# Altium schematic sheet CAN&QSPI.SchDoc: CAN & QSPI
size A4; DocumentNumber: MB1165; Revision: C.1; SheetNumber: 11; SheetTotal: 17; Project: STM32469I-EVAL
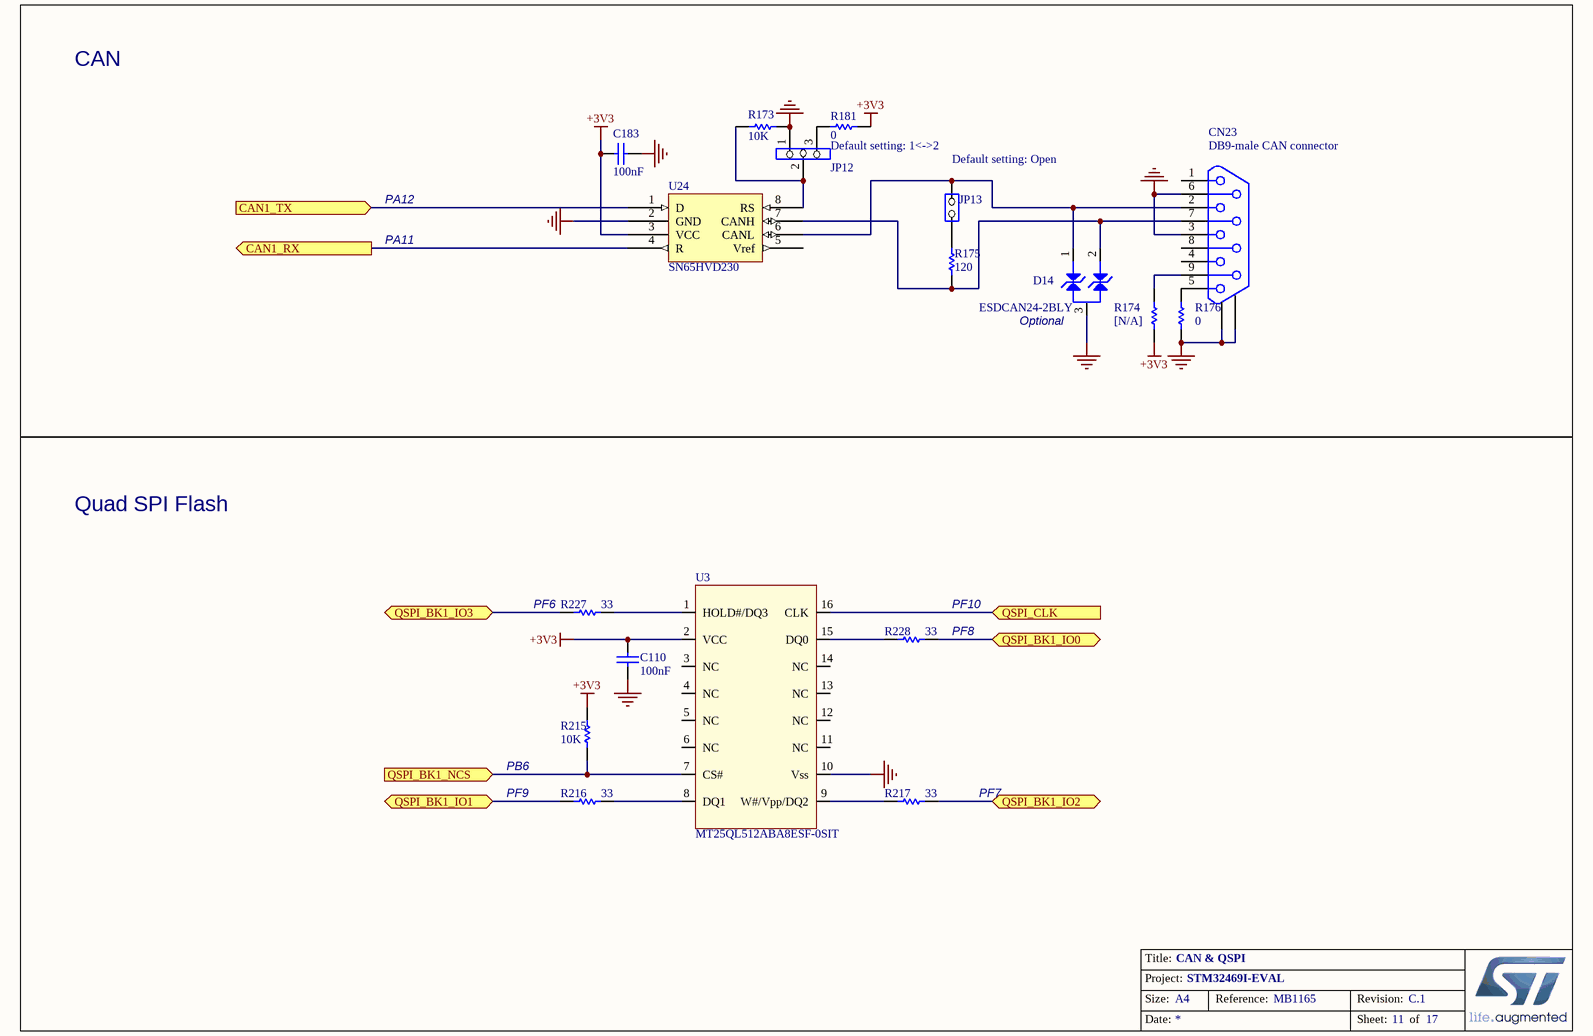
[diagram p0: CAN&QSPI.SchDoc]

## Parts
C110  100nF  [0402C]
C183  100nF  [0603C]
CN23  DB9-male CAN connector  [DB9/M]
D14  ESDCAN24-2BLY  [SOT-23]
JP12  (no value)  [SIP3]
JP13  (no value)  [SIP2]
R173  10K  [0603R]
R174  [N/A]  [0603R]
R175  120  [0603R]
R176  0  [0603R]
R181  0  [0603R]
R215  10K  [0402R]
R216  33  [0603R]
R217  33  [0603R]
R227  33  [0603R]
R228  33  [0603R]
U3  MT25QL512ABA8ESF-0SIT  [SOIC16W_1R27_10R3X10R33]
U24  SN65HVD230  [SOIC8_1R27_4R9X6]

## Ports
CAN1_RX (out), CAN1_TX (in), QSPI_BK1_IO0 (bidir), QSPI_BK1_IO1 (bidir), QSPI_BK1_IO2 (bidir), QSPI_BK1_IO3 (bidir), QSPI_BK1_NCS (in), QSPI_CLK (in)

## Nets
+3V3: C110.1 C183.1 R174.1 R181.2 R215.1 U3.2(VCC) U24.3(VCC)
GND: C110.2 C183.2 CN23.3 CN23.6 CN23.10 CN23.11 D14.3 JP12.1 R173.2 R176.1 U3.10(Vss) U24.2(GND)
CAN1_RX: U24.4(R) ; port CAN1_RX
CAN1_TX: U24.1(D) ; port CAN1_TX
QSPI_BK1_IO0: R228.1 ; port QSPI_BK1_IO0
QSPI_BK1_IO1: R216.2 ; port QSPI_BK1_IO1
QSPI_BK1_IO2: R217.1 ; port QSPI_BK1_IO2
QSPI_BK1_IO3: R227.2 ; port QSPI_BK1_IO3
QSPI_BK1_NCS: R215.2 U3.7(CS#) ; port QSPI_BK1_NCS
QSPI_CLK: U3.16(CLK) ; port QSPI_CLK
NetCN23_2: CN23.2 D14.1 JP13.2(NO) U24.6(CANL)
NetCN23_5: CN23.5 R176.2
NetCN23_7: CN23.7 D14.2 R175.1 U24.7(CANH)
NetCN23_9: CN23.9 R174.2
NetJP12_2: JP12.2 R173.1 U24.8(RS)
NetJP12_3: JP12.3 R181.1
NetJP13_1: JP13.1(COMMON) R175.2
NetR216_1: R216.1 U3.8(DQ1)
NetR217_2: R217.2 U3.9(W#/Vpp/DQ2)
NetR227_1: R227.1 U3.1(HOLD#/DQ3)
NetR228_2: R228.2 U3.15(DQ0)

Not connected (* = marked no-connect by the designer): CN23 1 4 8; U3 3(NC) 4(NC) 5(NC) 6(NC) 11(NC) 12(NC) 13(NC) 14(NC); U24 5(Vref)

## Notes on the sheet
- CAN
- Default setting: 1<->2
- (near JP13) Default setting: Open
- PA12
- PA11
- (near D14) Optional
- Quad SPI Flash
- (near R227) PF6
- (near R228) PF8
- (near R228) PF10
- PB6
- PF9
- (near R217) PF7
- Title:
- Project:
- Size:
- Date:
- A4
- Reference:
- Sheet:
- Revision:
- of

## Library data of the parts
C110 = Cap: Capacitor; Value: 10nF; Ordered by: Subcon; Published: 8-Jun-2000; Revision: July-2002: Re-released for DXP Platform.; Publisher: Altium Limited
C183 = Cap: Capacitor; Value: 10nF; Published: 8-Jun-2000; Revision: July-2002: Re-released for DXP Platform.; Publisher: Altium Limited
CN23 = DB9-CAN
JP12 = Jumper3
JP13 = JP2
R173 R216 R217 R227 R228 = Res1: Resistor; Value: 1K; Published: 8-Jun-2000; Revision: July-2002: Re-released for DXP Platform.; Publisher: Altium Limited
R174-R176 R181 = res1: Resistor; Value: 1K; Published: 8-Jun-2000; Revision: July-2002: Re-released for DXP Platform.; Publisher: Altium Limited
R215 = res1: Resistor; Value: 1K; Ordered by: Subcon; Published: 8-Jun-2000; Revision: July-2002: Re-released for DXP Platform.; Publisher: Altium Limited
U3 = QSPI_16pins: ECCN_US/EU: 3A991
U24 = SN65HVD230D